# Altium project LPCB230__RLOOP__THERMAL_IF.PrjPCB
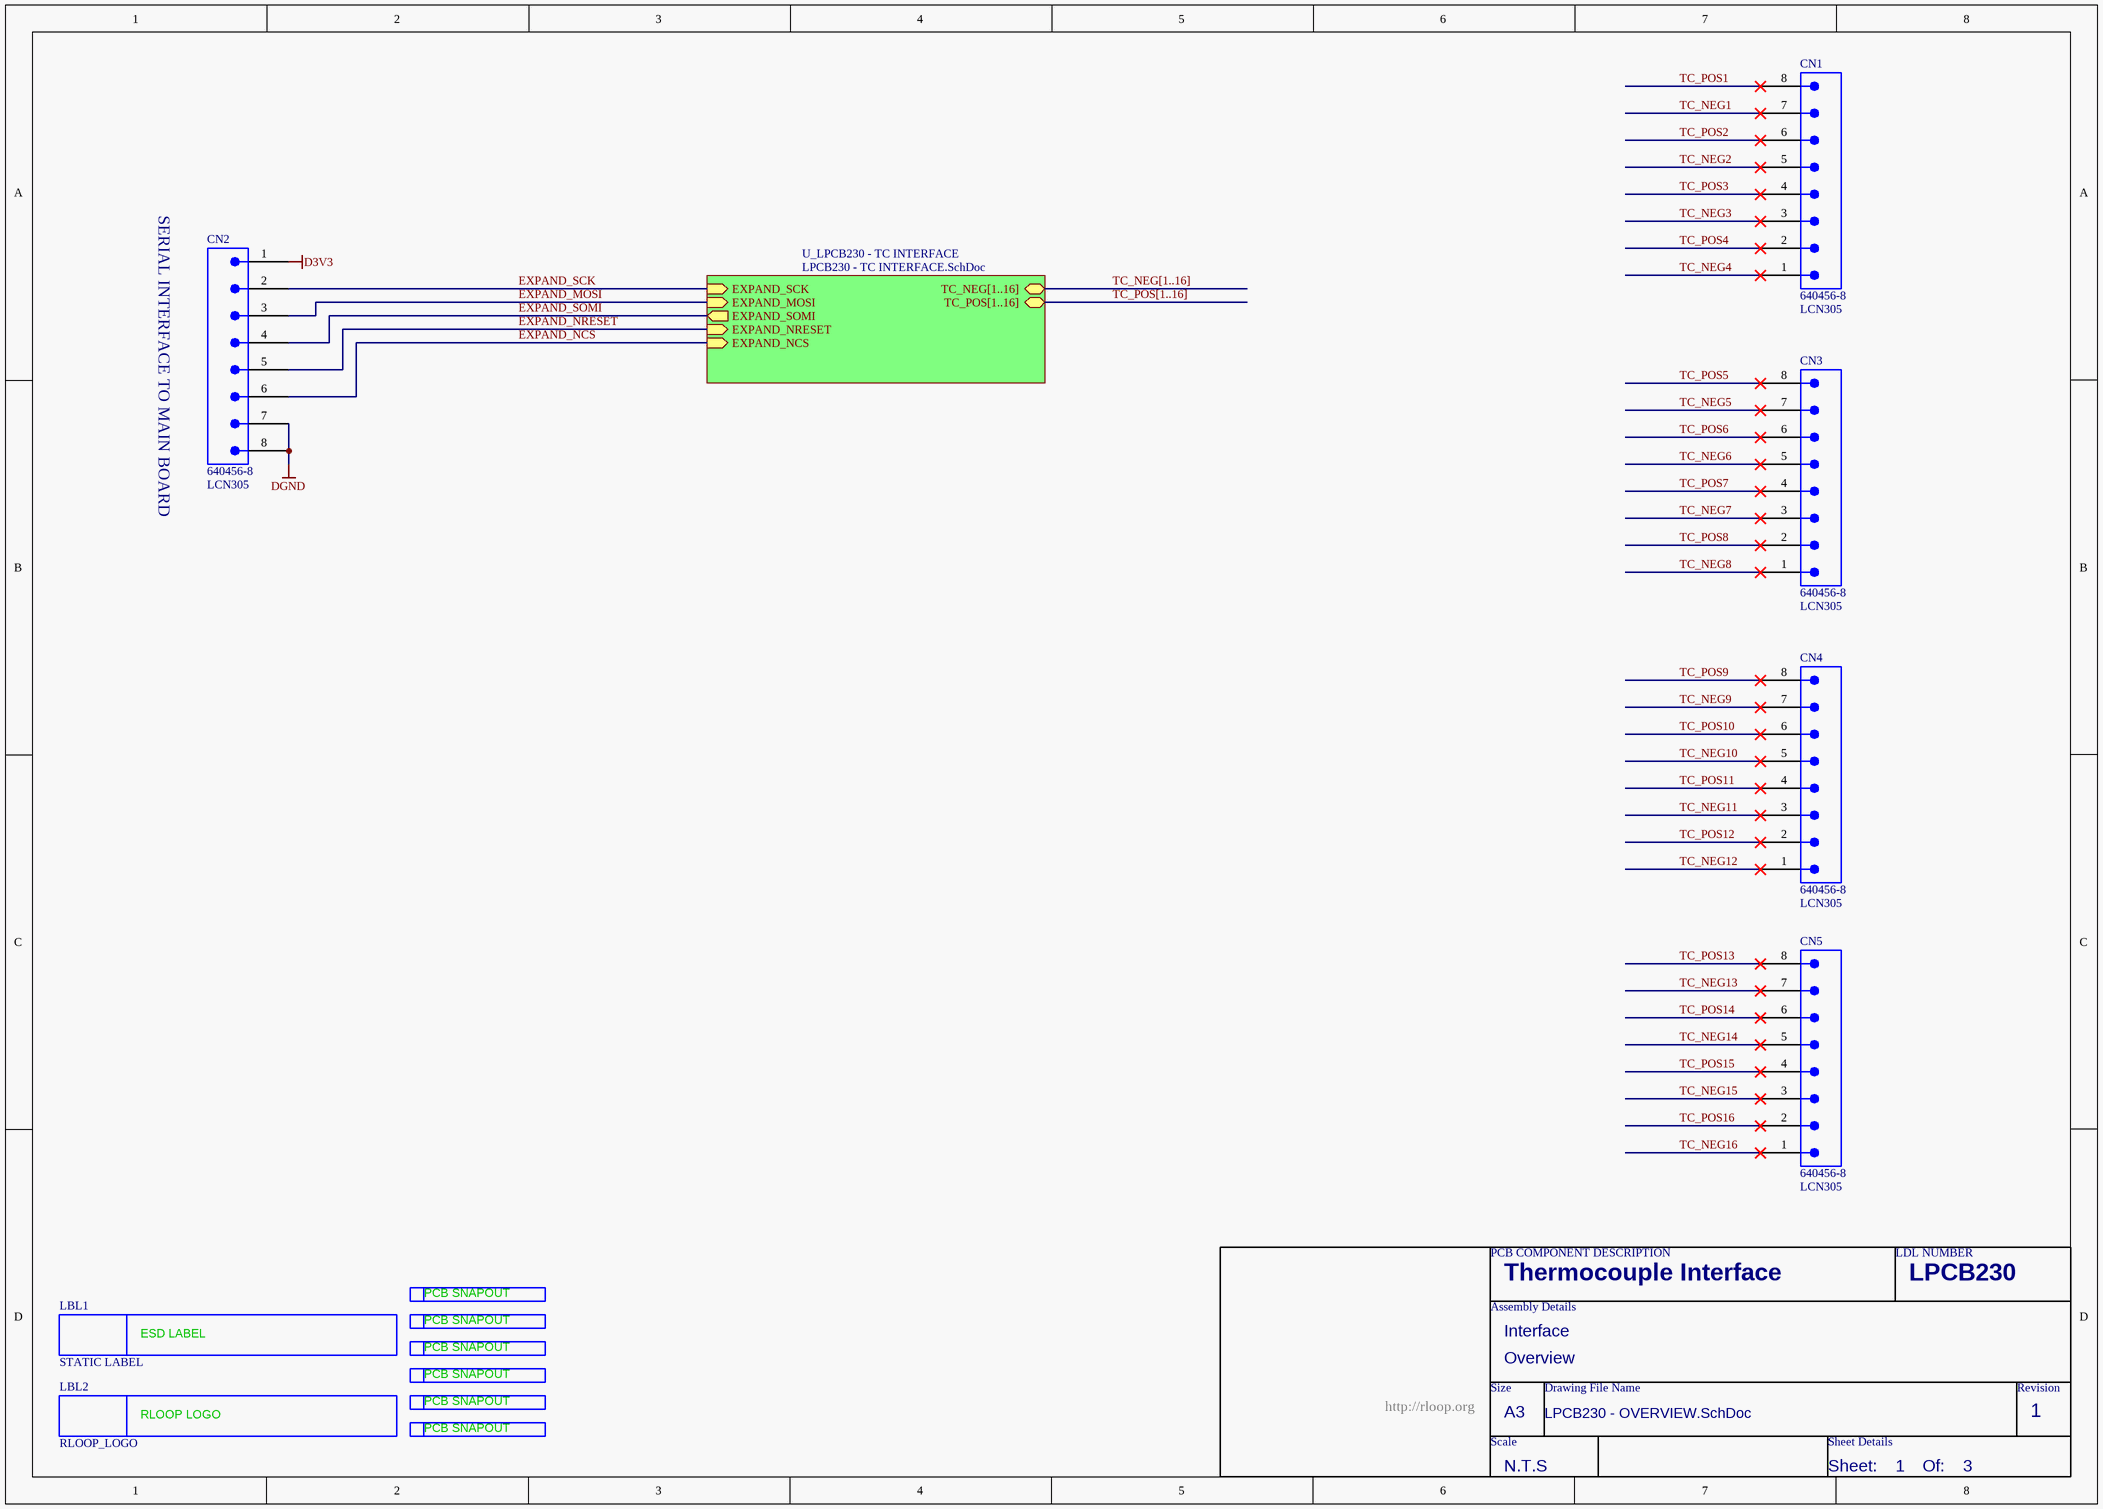
[diagram p0: LPCB230 - OVERVIEW.SchDoc]
3 sheets, 64 parts. Net scope: hierarchical (ports join the sheet entries above them; power ports are global).
Board files: LPCB230R0.PcbDoc, LPCB230R0__ASCII.PcbDoc
Sheets:
  LPCB230 - OVERVIEW.SchDoc
    U_LPCB230 - TC INTERFACE = LPCB230 - TC INTERFACE.SchDoc
      TC1 = LPCB230 - TC CHANNEL.SchDoc
      TC2 = LPCB230 - TC CHANNEL.SchDoc
      TC3 = LPCB230 - TC CHANNEL.SchDoc
      TC4 = LPCB230 - TC CHANNEL.SchDoc
      TC5 = LPCB230 - TC CHANNEL.SchDoc
      TC6 = LPCB230 - TC CHANNEL.SchDoc
      TC7 = LPCB230 - TC CHANNEL.SchDoc
      TC8 = LPCB230 - TC CHANNEL.SchDoc
      TC9 = LPCB230 - TC CHANNEL.SchDoc
      TC10 = LPCB230 - TC CHANNEL.SchDoc
      TC11 = LPCB230 - TC CHANNEL.SchDoc
      TC12 = LPCB230 - TC CHANNEL.SchDoc
      TC13 = LPCB230 - TC CHANNEL.SchDoc
      TC14 = LPCB230 - TC CHANNEL.SchDoc
      TC15 = LPCB230 - TC CHANNEL.SchDoc
      TC16 = LPCB230 - TC CHANNEL.SchDoc

## Sheet LPCB230 - OVERVIEW.SchDoc
size A3; Address1: Factory 10; Address2: 9-13 Dingley Avenue, Dandeong, VICTORIA 3175, AUSTRALIA; DocumentNumber: 1; Revision: 1; SheetNumber: 1; SheetTotal: 3; Lockie__PCB_SUB_ASSEMBLY: Overview; Lockie__PCB_ASSEMBLY: Interface; Lockie__LDL: LPCB230; Lockie__PCB_DESCRIPTION: Thermocouple Interface

### Parts
CN1  640456-8  LDL_NUMBER: LCN305  [640456-8]
CN2  640456-8  LDL_NUMBER: LCN305  [640456-8]
CN3  640456-8  LDL_NUMBER: LCN305  [640456-8]
CN4  640456-8  LDL_NUMBER: LCN305  [640456-8]
CN5  640456-8  LDL_NUMBER: LCN305  [640456-8]
LBL1  STATIC LABEL  [STATIC_LABEL]  (no BOM)
LBL2  RLOOP_LOGO  [RLOOP_LOGO]  (no BOM)
SN1  PCB_SNAPOUT  [SNAPOUT_NEW]  (value not drawn)  (no BOM)
SN2  PCB_SNAPOUT  [SNAPOUT_NEW]  (value not drawn)  (no BOM)
SN3  PCB_SNAPOUT  [SNAPOUT_NEW]  (value not drawn)  (no BOM)
SN4  PCB_SNAPOUT  [SNAPOUT_NEW]  (value not drawn)  (no BOM)
SN5  PCB_SNAPOUT  [SNAPOUT_NEW]  (value not drawn)  (no BOM)
SN6  PCB_SNAPOUT  [SNAPOUT_NEW]  (value not drawn)  (no BOM)

### Sub-sheets
U_LPCB230 - TC INTERFACE = LPCB230 - TC INTERFACE.SchDoc: EXPAND_SCK (in), EXPAND_MOSI (in), EXPAND_SOMI (out), EXPAND_NCS (in), EXPAND_NRESET (in), TC_NEG[1..16] (bidir), TC_POS[1..16] (bidir)

### Nets
D3V3: CN2.1
DGND: CN2.7 CN2.8
EXPAND_MOSI: CN2.3 ; sheet U_LPCB230 - TC INTERFACE/EXPAND_MOSI
EXPAND_NCS: CN2.6 ; sheet U_LPCB230 - TC INTERFACE/EXPAND_NCS
EXPAND_NRESET: CN2.5 ; sheet U_LPCB230 - TC INTERFACE/EXPAND_NRESET
EXPAND_SCK: CN2.2 ; sheet U_LPCB230 - TC INTERFACE/EXPAND_SCK
EXPAND_SOMI: CN2.4 ; sheet U_LPCB230 - TC INTERFACE/EXPAND_SOMI
TC_NEG1: CN1.7
TC_NEG2: CN1.5
TC_NEG3: CN1.3
TC_NEG4: CN1.1
TC_NEG5: CN3.7
TC_NEG6: CN3.5
TC_NEG7: CN3.3
TC_NEG8: CN3.1
TC_NEG9: CN4.7
TC_NEG10: CN4.5
TC_NEG11: CN4.3
TC_NEG12: CN4.1
TC_NEG13: CN5.7
TC_NEG14: CN5.5
TC_NEG15: CN5.3
TC_NEG16: CN5.1
TC_POS1: CN1.8
TC_POS2: CN1.6
TC_POS3: CN1.4
TC_POS4: CN1.2
TC_POS5: CN3.8
TC_POS6: CN3.6
TC_POS7: CN3.4
TC_POS8: CN3.2
TC_POS9: CN4.8
TC_POS10: CN4.6
TC_POS11: CN4.4
TC_POS12: CN4.2
TC_POS13: CN5.8
TC_POS14: CN5.6
TC_POS15: CN5.4
TC_POS16: CN5.2

### Buses and harness runs
bus TC_NEG[1..16] = sheet U_LPCB230 - TC INTERFACE/TC_NEG[1..16]
bus TC_POS[1..16] = sheet U_LPCB230 - TC INTERFACE/TC_POS[1..16]

### Notes on the sheet
- SERIAL INTERFACE TO MAIN BOARD
- PCB COMPONENT DESCRIPTION
- LDL NUMBER
- Assembly Details
- Size
- Drawing File Name
- Revision
- http://rloop.org
- Scale
- A3
- Sheet Details
- N.T.S
- Sheet:
- Of:
- (in symbol PCB_SNAPOUT) PCB SNAPOUT
- (in symbol RLOOP_LOGO) RLOOP LOGO
- (in symbol STATIC LABEL) ESD LABEL

### Library data of the parts
CN1-CN5 = 640456-8: Connector, Male Header, 8 Way; FMEDA__CHANNEL: COM; FMEDA__OPERATING__CURRENT_MAX: 0; FMEDA__OPERATING__TEMP_MAX: 50; FMEDA__OPERATING__TEMP_MIN: -20; FMEDA__OPERATING__TEMP_TYP: 27; FMEDA__OPERATING__VOLTAGE_MAX: 16; FMEDA__OPERATING__VOLTAGE_TYP: 12; FMEDA__FUNCTION_IN_SYSTEM: *; FMEDA__OPERATING__CURRENT_MIN: 0; FMEDA__OPERATING__CURRENT_TYP: 0; FMEDA__OPERATING__VOLTAGE_MIN: 0
LBL1 = STATIC LABEL: FMEDA__CHANNEL: DIAG; FMEDA__FUNCTION_IN_SYSTEM: *
LBL2 = RLOOP_LOGO: FMEDA__CHANNEL: DIAG; FMEDA__FUNCTION_IN_SYSTEM: *
SN1-SN6 = PCB_SNAPOUT: FMEDA__CHANNEL: DIAG; FMEDA__FUNCTION_IN_SYSTEM: *

## Sheet LPCB230 - TC INTERFACE.SchDoc
size A3; Address1: Factory 10; Address2: 9-13 Dingley Avenue, Dandeong, VICTORIA 3175, AUSTRALIA; DocumentNumber: 2; Revision: 1; SheetNumber: 2; SheetTotal: 3; Lockie__PCB_SUB_ASSEMBLY: Interface; Lockie__PCB_ASSEMBLY: Interface; Lockie__LDL: LPCB230; Lockie__PCB_DESCRIPTION: Thermocouple Interface
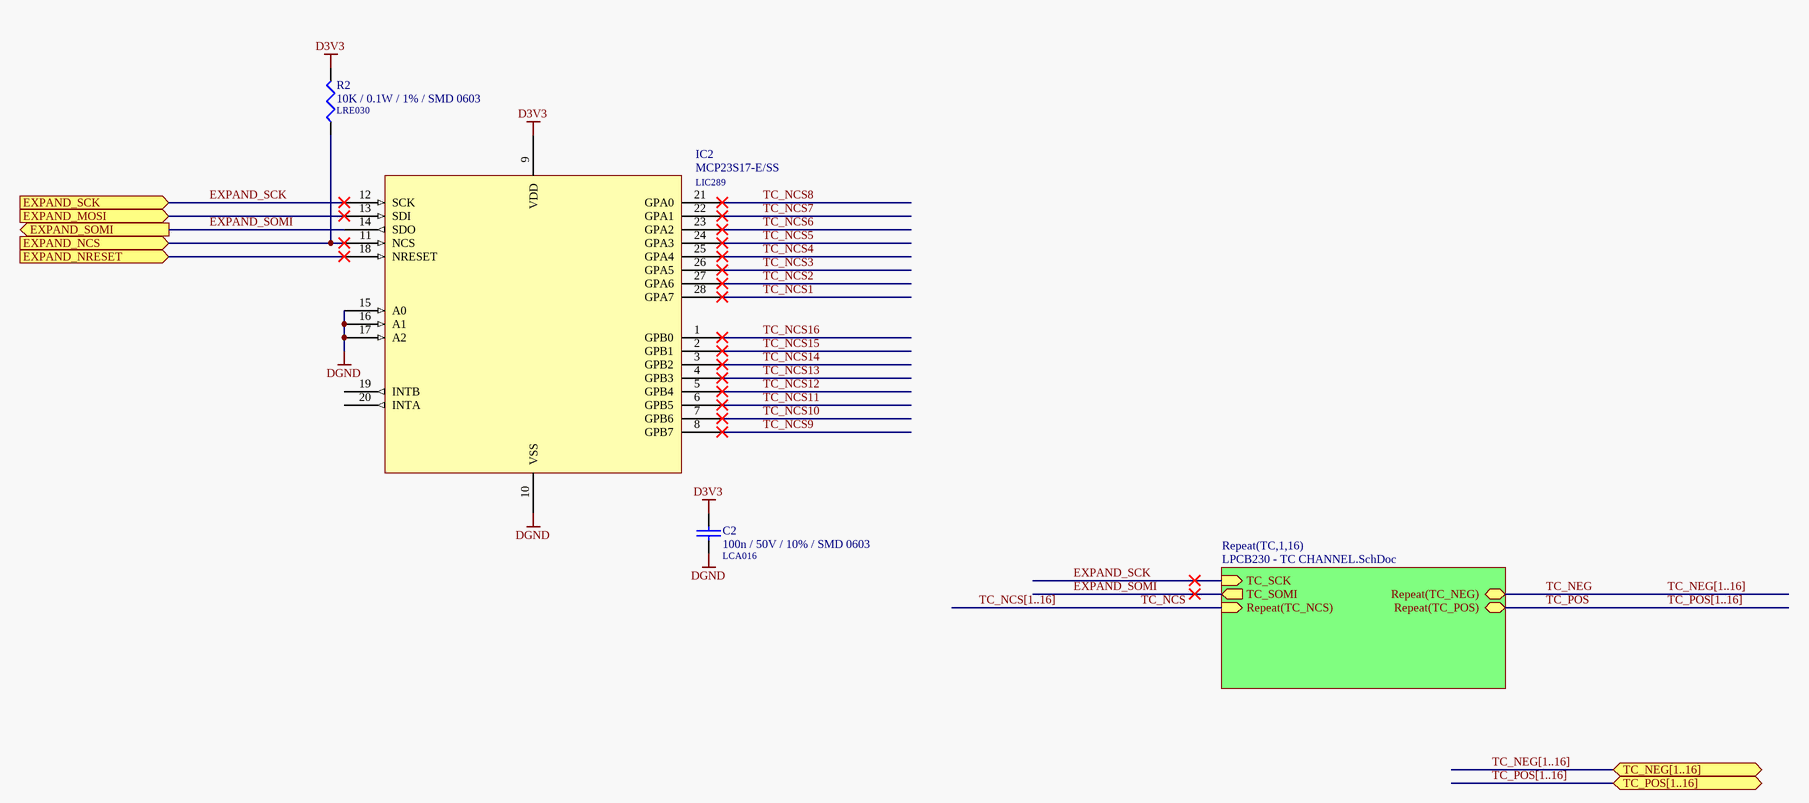
[diagram p1: LPCB230 - TC INTERFACE.SchDoc]

### Parts
C2  100n / 50V / 10% / SMD 0603  LDL_NUMBER: LCA016  [LFP011__CC1608-0603-IPC7351_B]
IC2  MCP23S17-E/SS  LDL_NUMBER: LIC289  [LFP050__SSOP28]
R2  10K / 0.1W / 1% / SMD 0603  LDL_NUMBER: LRE030  [LFP020__CR1608-0603-IPC7351_B]

### Sub-sheets
Repeat(TC,1,16) = LPCB230 - TC CHANNEL.SchDoc: Repeat(TC_NEG) (bidir), Repeat(TC_POS) (bidir), TC_SCK (in), TC_SOMI (out), Repeat(TC_NCS) (in)

### Ports
EXPAND_MOSI (in), EXPAND_NCS (in), EXPAND_NRESET (in), EXPAND_SCK (in), EXPAND_SOMI (out), TC_NEG[1..16] (bidir), TC_POS[1..16] (bidir)

### Nets
D3V3: C2.1 IC2.9(VDD) R2.2
DGND: C2.2 IC2.10(VSS) IC2.15(A0) IC2.16(A1) IC2.17(A2)
EXPAND_MOSI: IC2.13(SDI) ; port EXPAND_MOSI
EXPAND_NCS: IC2.11(NCS) R2.1 ; port EXPAND_NCS
EXPAND_NRESET: IC2.18(NRESET) ; port EXPAND_NRESET
EXPAND_SCK: IC2.12(SCK) ; port EXPAND_SCK, sheet Repeat(TC,1,16)/TC_SCK
EXPAND_SOMI: IC2.14(SDO) ; port EXPAND_SOMI, sheet Repeat(TC,1,16)/TC_SOMI
TC_NCS: sheet Repeat(TC,1,16)/Repeat(TC_NCS)
TC_NCS1: IC2.28(GPA7)
TC_NCS2: IC2.27(GPA6)
TC_NCS3: IC2.26(GPA5)
TC_NCS4: IC2.25(GPA4)
TC_NCS5: IC2.24(GPA3)
TC_NCS6: IC2.23(GPA2)
TC_NCS7: IC2.22(GPA1)
TC_NCS8: IC2.21(GPA0)
TC_NCS9: IC2.8(GPB7)
TC_NCS10: IC2.7(GPB6)
TC_NCS11: IC2.6(GPB5)
TC_NCS12: IC2.5(GPB4)
TC_NCS13: IC2.4(GPB3)
TC_NCS14: IC2.3(GPB2)
TC_NCS15: IC2.2(GPB1)
TC_NCS16: IC2.1(GPB0)
TC_NEG: sheet Repeat(TC,1,16)/Repeat(TC_NEG)
TC_POS: sheet Repeat(TC,1,16)/Repeat(TC_POS)

Not connected (* = marked no-connect by the designer): IC2 19(INTB) 20(INTA)

### Buses and harness runs
bus TC_NCS[1..16]
bus TC_NEG[1..16]
bus TC_NEG[1..16] = port TC_NEG[1..16]
bus TC_POS[1..16]
bus TC_POS[1..16] = port TC_POS[1..16]

### Notes on the sheet
- PCB COMPONENT DESCRIPTION
- LDL NUMBER
- Assembly Details
- Size
- Drawing File Name
- Revision
- http://rloop.org
- Scale
- A3
- Sheet Details
- N.T.S
- Sheet:
- Of:

### Library data of the parts
C2 = 100n / 50V / 10% / SMD 0603: Capacitor, Ceramic Chip, 100nF (0.1uF), 50V, 5%, SMD 0603 [LCA016]; FMEDA__OPERATING__VOLTAGE_MIN: 0; FMEDA__OPERATING__VOLTAGE_MAX: 3.3; FMEDA__OPERATING__TEMP_MIN: -20; FMEDA__OPERATING__TEMP_TYP: 27; FMEDA__OPERATING__TEMP_MAX: 50; FMEDA__CHANNEL: COM; Value: 100n; FMEDA__FUNCTION_IN_SYSTEM: *; FMEDA__OPERATING__VOLTAGE_TYP: 3.3
IC2 = MCP23S17-E/SS: IC, SPI IO Expander, 16bit, SMD SSOP28 [LIC289]; FMEDA__OPERATING__TEMP_MIN: -20; FMEDA__OPERATING__TEMP_TYP: 27; FMEDA__OPERATING__TEMP_MAX: 50; FMEDA__OPERATING__VOLTAGE_MIN: 0; FMEDA__OPERATING__VOLTAGE_TYP: 3.3; FMEDA__CHANNEL: COM; FMEDA__FUNCTION_IN_SYSTEM: *; FMEDA__OPERATING__VOLTAGE_MAX: 3.3
R2 = 10K / 0.1W / 1% / SMD 0603: Resistor, Ceramic Chip, 10K, 0.1W, 1%, SMD 0603 [LRE030]; FMEDA__OPERATING__POWER_MAX: 0; FMEDA__OPERATING__TEMP_MAX: 50; FMEDA__OPERATING__TEMP_MIN: -20; FMEDA__OPERATING__TEMP_TYP: 27; FMEDA__CHANNEL: COM; Value: 10K; FMEDA__OPERATING__POWER_MIN: 0; FMEDA__OPERATING__VOLTAGE_MAX: 0; FMEDA__OPERATING__VOLTAGE_MIN: 0; FMEDA__OPERATING__VOLTAGE_TYP: 0; FMEDA__FUNCTION_IN_SYSTEM: *

## Sheet LPCB230 - TC CHANNEL.SchDoc
size A3; Address1: Factory 10; Address2: 9-13 Dingley Avenue, Dandeong, VICTORIA 3175, AUSTRALIA; DocumentNumber: 3; Revision: 1; SheetNumber: 3; SheetTotal: 3; Lockie__PCB_SUB_ASSEMBLY: Single Channel; Lockie__PCB_ASSEMBLY: Interface; Lockie__LDL: LPCB230; Lockie__PCB_DESCRIPTION: Thermocouple Interface
Used 16 times, as channels U_LPCB230 - TC INTERFACE/TC1, U_LPCB230 - TC INTERFACE/TC2, U_LPCB230 - TC INTERFACE/TC3, U_LPCB230 - TC INTERFACE/TC4, U_LPCB230 - TC INTERFACE/TC5, U_LPCB230 - TC INTERFACE/TC6, U_LPCB230 - TC INTERFACE/TC7, U_LPCB230 - TC INTERFACE/TC8, U_LPCB230 - TC INTERFACE/TC9, U_LPCB230 - TC INTERFACE/TC10, U_LPCB230 - TC INTERFACE/TC11, U_LPCB230 - TC INTERFACE/TC12, U_LPCB230 - TC INTERFACE/TC13, U_LPCB230 - TC INTERFACE/TC14, U_LPCB230 - TC INTERFACE/TC15, U_LPCB230 - TC INTERFACE/TC16. Parts and nets are listed once, with the designators drawn on the sheet.
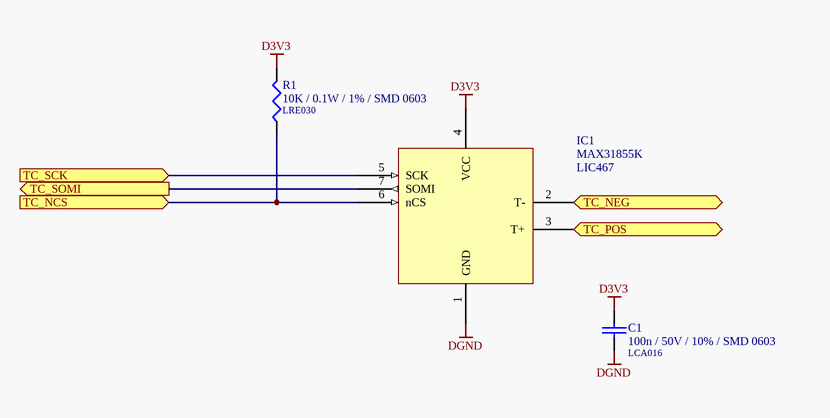
[diagram p2: LPCB230 - TC CHANNEL.SchDoc]

### Parts
C1  100n / 50V / 10% / SMD 0603  LDL_NUMBER: LCA016  [LFP011__CC1608-0603-IPC7351_B]
IC1  MAX31855K  LDL_NUMBER: LIC467  [LFP017__SO-G8/Y1.9]
R1  10K / 0.1W / 1% / SMD 0603  LDL_NUMBER: LRE030  [LFP020__CR1608-0603-IPC7351_B]

### Ports
TC_NCS (in), TC_NEG (bidir), TC_POS (bidir), TC_SCK (in), TC_SOMI (out)

### Nets
D3V3: C1.1 IC1.4(VCC) R1.2
DGND: C1.2 IC1.1(GND)
TC_NCS: IC1.6(nCS) R1.1 ; port TC_NCS
TC_NEG: IC1.2(T-) ; port TC_NEG
TC_POS: IC1.3(T+) ; port TC_POS
TC_SCK: IC1.5(SCK) ; port TC_SCK
TC_SOMI: IC1.7(SOMI) ; port TC_SOMI

### Channels
U_LPCB230 - TC INTERFACE/TC1: designators end in _TC1; ports TC_NCS=TC_NCS1 TC_NEG=TC_NEG1 TC_POS=TC_POS1 TC_SCK=EXPAND_SCK TC_SOMI=EXPAND_SOMI
U_LPCB230 - TC INTERFACE/TC2: designators end in _TC2; ports TC_NCS=TC_NCS2 TC_NEG=TC_NEG2 TC_POS=TC_POS2 TC_SCK=EXPAND_SCK TC_SOMI=EXPAND_SOMI
U_LPCB230 - TC INTERFACE/TC3: designators end in _TC3; ports TC_NCS=TC_NCS3 TC_NEG=TC_NEG3 TC_POS=TC_POS3 TC_SCK=EXPAND_SCK TC_SOMI=EXPAND_SOMI
U_LPCB230 - TC INTERFACE/TC4: designators end in _TC4; ports TC_NCS=TC_NCS4 TC_NEG=TC_NEG4 TC_POS=TC_POS4 TC_SCK=EXPAND_SCK TC_SOMI=EXPAND_SOMI
U_LPCB230 - TC INTERFACE/TC5: designators end in _TC5; ports TC_NCS=TC_NCS5 TC_NEG=TC_NEG5 TC_POS=TC_POS5 TC_SCK=EXPAND_SCK TC_SOMI=EXPAND_SOMI
U_LPCB230 - TC INTERFACE/TC6: designators end in _TC6; ports TC_NCS=TC_NCS6 TC_NEG=TC_NEG6 TC_POS=TC_POS6 TC_SCK=EXPAND_SCK TC_SOMI=EXPAND_SOMI
U_LPCB230 - TC INTERFACE/TC7: designators end in _TC7; ports TC_NCS=TC_NCS7 TC_NEG=TC_NEG7 TC_POS=TC_POS7 TC_SCK=EXPAND_SCK TC_SOMI=EXPAND_SOMI
U_LPCB230 - TC INTERFACE/TC8: designators end in _TC8; ports TC_NCS=TC_NCS8 TC_NEG=TC_NEG8 TC_POS=TC_POS8 TC_SCK=EXPAND_SCK TC_SOMI=EXPAND_SOMI
U_LPCB230 - TC INTERFACE/TC9: designators end in _TC9; ports TC_NCS=TC_NCS9 TC_NEG=TC_NEG9 TC_POS=TC_POS9 TC_SCK=EXPAND_SCK TC_SOMI=EXPAND_SOMI
U_LPCB230 - TC INTERFACE/TC10: designators end in _TC10; ports TC_NCS=TC_NCS10 TC_NEG=TC_NEG10 TC_POS=TC_POS10 TC_SCK=EXPAND_SCK TC_SOMI=EXPAND_SOMI
U_LPCB230 - TC INTERFACE/TC11: designators end in _TC11; ports TC_NCS=TC_NCS11 TC_NEG=TC_NEG11 TC_POS=TC_POS11 TC_SCK=EXPAND_SCK TC_SOMI=EXPAND_SOMI
U_LPCB230 - TC INTERFACE/TC12: designators end in _TC12; ports TC_NCS=TC_NCS12 TC_NEG=TC_NEG12 TC_POS=TC_POS12 TC_SCK=EXPAND_SCK TC_SOMI=EXPAND_SOMI
U_LPCB230 - TC INTERFACE/TC13: designators end in _TC13; ports TC_NCS=TC_NCS13 TC_NEG=TC_NEG13 TC_POS=TC_POS13 TC_SCK=EXPAND_SCK TC_SOMI=EXPAND_SOMI
U_LPCB230 - TC INTERFACE/TC14: designators end in _TC14; ports TC_NCS=TC_NCS14 TC_NEG=TC_NEG14 TC_POS=TC_POS14 TC_SCK=EXPAND_SCK TC_SOMI=EXPAND_SOMI
U_LPCB230 - TC INTERFACE/TC15: designators end in _TC15; ports TC_NCS=TC_NCS15 TC_NEG=TC_NEG15 TC_POS=TC_POS15 TC_SCK=EXPAND_SCK TC_SOMI=EXPAND_SOMI
U_LPCB230 - TC INTERFACE/TC16: designators end in _TC16; ports TC_NCS=TC_NCS16 TC_NEG=TC_NEG16 TC_POS=TC_POS16 TC_SCK=EXPAND_SCK TC_SOMI=EXPAND_SOMI

### Notes on the sheet
- PCB COMPONENT DESCRIPTION
- LDL NUMBER
- Assembly Details
- Size
- Drawing File Name
- Revision
- http://rloop.org
- Scale
- A3
- Sheet Details
- N.T.S
- Sheet:
- Of:

### Library data of the parts
C1 = 100n / 50V / 10% / SMD 0603: as C2 on sheet LPCB230 - TC INTERFACE; Value: 100n; FMEDA__FUNCTION_IN_SYSTEM: *; FMEDA__OPERATING__VOLTAGE_TYP: 3.3
IC1 = MAX31855K: IC, Thermocouple Interface, Type K, SMD SOIC-8 [LIC467]
R1 = 10K / 0.1W / 1% / SMD 0603: as R2 on sheet LPCB230 - TC INTERFACE; Value: 10K; FMEDA__OPERATING__POWER_MIN: 0; FMEDA__OPERATING__VOLTAGE_MAX: 0; FMEDA__OPERATING__VOLTAGE_MIN: 0; FMEDA__OPERATING__VOLTAGE_TYP: 0; FMEDA__FUNCTION_IN_SYSTEM: *

## Nets that join several sheets
D3V3: LPCB230 - OVERVIEW (CN2.1), LPCB230 - TC INTERFACE (C2.1 IC2.9 R2.2), U_LPCB230 - TC INTERFACE/TC1 (C1_TC1.1 IC1_TC1.4 R1_TC1.2), U_LPCB230 - TC INTERFACE/TC2 (C1_TC2.1 IC1_TC2.4 R1_TC2.2), U_LPCB230 - TC INTERFACE/TC3 (C1_TC3.1 IC1_TC3.4 R1_TC3.2), U_LPCB230 - TC INTERFACE/TC4 (C1_TC4.1 IC1_TC4.4 R1_TC4.2), U_LPCB230 - TC INTERFACE/TC5 (C1_TC5.1 IC1_TC5.4 R1_TC5.2), U_LPCB230 - TC INTERFACE/TC6 (C1_TC6.1 IC1_TC6.4 R1_TC6.2), U_LPCB230 - TC INTERFACE/TC7 (C1_TC7.1 IC1_TC7.4 R1_TC7.2), U_LPCB230 - TC INTERFACE/TC8 (C1_TC8.1 IC1_TC8.4 R1_TC8.2), U_LPCB230 - TC INTERFACE/TC9 (C1_TC9.1 IC1_TC9.4 R1_TC9.2), U_LPCB230 - TC INTERFACE/TC10 (C1_TC10.1 IC1_TC10.4 R1_TC10.2), U_LPCB230 - TC INTERFACE/TC11 (C1_TC11.1 IC1_TC11.4 R1_TC11.2), U_LPCB230 - TC INTERFACE/TC12 (C1_TC12.1 IC1_TC12.4 R1_TC12.2), U_LPCB230 - TC INTERFACE/TC13 (C1_TC13.1 IC1_TC13.4 R1_TC13.2), U_LPCB230 - TC INTERFACE/TC14 (C1_TC14.1 IC1_TC14.4 R1_TC14.2), U_LPCB230 - TC INTERFACE/TC15 (C1_TC15.1 IC1_TC15.4 R1_TC15.2), U_LPCB230 - TC INTERFACE/TC16 (C1_TC16.1 IC1_TC16.4 R1_TC16.2)
DGND: LPCB230 - OVERVIEW (CN2.7 CN2.8), LPCB230 - TC INTERFACE (5 pins), U_LPCB230 - TC INTERFACE/TC1 (C1_TC1.2 IC1_TC1.1), U_LPCB230 - TC INTERFACE/TC2 (C1_TC2.2 IC1_TC2.1), U_LPCB230 - TC INTERFACE/TC3 (C1_TC3.2 IC1_TC3.1), U_LPCB230 - TC INTERFACE/TC4 (C1_TC4.2 IC1_TC4.1), U_LPCB230 - TC INTERFACE/TC5 (C1_TC5.2 IC1_TC5.1), U_LPCB230 - TC INTERFACE/TC6 (C1_TC6.2 IC1_TC6.1), U_LPCB230 - TC INTERFACE/TC7 (C1_TC7.2 IC1_TC7.1), U_LPCB230 - TC INTERFACE/TC8 (C1_TC8.2 IC1_TC8.1), U_LPCB230 - TC INTERFACE/TC9 (C1_TC9.2 IC1_TC9.1), U_LPCB230 - TC INTERFACE/TC10 (C1_TC10.2 IC1_TC10.1), U_LPCB230 - TC INTERFACE/TC11 (C1_TC11.2 IC1_TC11.1), U_LPCB230 - TC INTERFACE/TC12 (C1_TC12.2 IC1_TC12.1), U_LPCB230 - TC INTERFACE/TC13 (C1_TC13.2 IC1_TC13.1), U_LPCB230 - TC INTERFACE/TC14 (C1_TC14.2 IC1_TC14.1), U_LPCB230 - TC INTERFACE/TC15 (C1_TC15.2 IC1_TC15.1), U_LPCB230 - TC INTERFACE/TC16 (C1_TC16.2 IC1_TC16.1)
EXPAND_MOSI: LPCB230 - OVERVIEW (CN2.3), LPCB230 - TC INTERFACE (IC2.13)
EXPAND_NCS: LPCB230 - OVERVIEW (CN2.6), LPCB230 - TC INTERFACE (IC2.11 R2.1)
EXPAND_NRESET: LPCB230 - OVERVIEW (CN2.5), LPCB230 - TC INTERFACE (IC2.18)
EXPAND_SCK: LPCB230 - OVERVIEW (CN2.2), LPCB230 - TC INTERFACE (IC2.12), U_LPCB230 - TC INTERFACE/TC1 (IC1_TC1.5), U_LPCB230 - TC INTERFACE/TC2 (IC1_TC2.5), U_LPCB230 - TC INTERFACE/TC3 (IC1_TC3.5), U_LPCB230 - TC INTERFACE/TC4 (IC1_TC4.5), U_LPCB230 - TC INTERFACE/TC5 (IC1_TC5.5), U_LPCB230 - TC INTERFACE/TC6 (IC1_TC6.5), U_LPCB230 - TC INTERFACE/TC7 (IC1_TC7.5), U_LPCB230 - TC INTERFACE/TC8 (IC1_TC8.5), U_LPCB230 - TC INTERFACE/TC9 (IC1_TC9.5), U_LPCB230 - TC INTERFACE/TC10 (IC1_TC10.5), U_LPCB230 - TC INTERFACE/TC11 (IC1_TC11.5), U_LPCB230 - TC INTERFACE/TC12 (IC1_TC12.5), U_LPCB230 - TC INTERFACE/TC13 (IC1_TC13.5), U_LPCB230 - TC INTERFACE/TC14 (IC1_TC14.5), U_LPCB230 - TC INTERFACE/TC15 (IC1_TC15.5), U_LPCB230 - TC INTERFACE/TC16 (IC1_TC16.5)
EXPAND_SOMI: LPCB230 - OVERVIEW (CN2.4), LPCB230 - TC INTERFACE (IC2.14), U_LPCB230 - TC INTERFACE/TC1 (IC1_TC1.7), U_LPCB230 - TC INTERFACE/TC2 (IC1_TC2.7), U_LPCB230 - TC INTERFACE/TC3 (IC1_TC3.7), U_LPCB230 - TC INTERFACE/TC4 (IC1_TC4.7), U_LPCB230 - TC INTERFACE/TC5 (IC1_TC5.7), U_LPCB230 - TC INTERFACE/TC6 (IC1_TC6.7), U_LPCB230 - TC INTERFACE/TC7 (IC1_TC7.7), U_LPCB230 - TC INTERFACE/TC8 (IC1_TC8.7), U_LPCB230 - TC INTERFACE/TC9 (IC1_TC9.7), U_LPCB230 - TC INTERFACE/TC10 (IC1_TC10.7), U_LPCB230 - TC INTERFACE/TC11 (IC1_TC11.7), U_LPCB230 - TC INTERFACE/TC12 (IC1_TC12.7), U_LPCB230 - TC INTERFACE/TC13 (IC1_TC13.7), U_LPCB230 - TC INTERFACE/TC14 (IC1_TC14.7), U_LPCB230 - TC INTERFACE/TC15 (IC1_TC15.7), U_LPCB230 - TC INTERFACE/TC16 (IC1_TC16.7)
TC_NCS1: LPCB230 - TC INTERFACE (IC2.28), U_LPCB230 - TC INTERFACE/TC1 (IC1_TC1.6 R1_TC1.1)
TC_NCS2: LPCB230 - TC INTERFACE (IC2.27), U_LPCB230 - TC INTERFACE/TC2 (IC1_TC2.6 R1_TC2.1)
TC_NCS3: LPCB230 - TC INTERFACE (IC2.26), U_LPCB230 - TC INTERFACE/TC3 (IC1_TC3.6 R1_TC3.1)
TC_NCS4: LPCB230 - TC INTERFACE (IC2.25), U_LPCB230 - TC INTERFACE/TC4 (IC1_TC4.6 R1_TC4.1)
TC_NCS5: LPCB230 - TC INTERFACE (IC2.24), U_LPCB230 - TC INTERFACE/TC5 (IC1_TC5.6 R1_TC5.1)
TC_NCS6: LPCB230 - TC INTERFACE (IC2.23), U_LPCB230 - TC INTERFACE/TC6 (IC1_TC6.6 R1_TC6.1)
TC_NCS7: LPCB230 - TC INTERFACE (IC2.22), U_LPCB230 - TC INTERFACE/TC7 (IC1_TC7.6 R1_TC7.1)
TC_NCS8: LPCB230 - TC INTERFACE (IC2.21), U_LPCB230 - TC INTERFACE/TC8 (IC1_TC8.6 R1_TC8.1)
TC_NCS9: LPCB230 - TC INTERFACE (IC2.8), U_LPCB230 - TC INTERFACE/TC9 (IC1_TC9.6 R1_TC9.1)
TC_NCS10: LPCB230 - TC INTERFACE (IC2.7), U_LPCB230 - TC INTERFACE/TC10 (IC1_TC10.6 R1_TC10.1)
TC_NCS11: LPCB230 - TC INTERFACE (IC2.6), U_LPCB230 - TC INTERFACE/TC11 (IC1_TC11.6 R1_TC11.1)
TC_NCS12: LPCB230 - TC INTERFACE (IC2.5), U_LPCB230 - TC INTERFACE/TC12 (IC1_TC12.6 R1_TC12.1)
TC_NCS13: LPCB230 - TC INTERFACE (IC2.4), U_LPCB230 - TC INTERFACE/TC13 (IC1_TC13.6 R1_TC13.1)
TC_NCS14: LPCB230 - TC INTERFACE (IC2.3), U_LPCB230 - TC INTERFACE/TC14 (IC1_TC14.6 R1_TC14.1)
TC_NCS15: LPCB230 - TC INTERFACE (IC2.2), U_LPCB230 - TC INTERFACE/TC15 (IC1_TC15.6 R1_TC15.1)
TC_NCS16: LPCB230 - TC INTERFACE (IC2.1), U_LPCB230 - TC INTERFACE/TC16 (IC1_TC16.6 R1_TC16.1)
TC_NEG1: LPCB230 - OVERVIEW (CN1.7), U_LPCB230 - TC INTERFACE/TC1 (IC1_TC1.2)
TC_NEG2: LPCB230 - OVERVIEW (CN1.5), U_LPCB230 - TC INTERFACE/TC2 (IC1_TC2.2)
TC_NEG3: LPCB230 - OVERVIEW (CN1.3), U_LPCB230 - TC INTERFACE/TC3 (IC1_TC3.2)
TC_NEG4: LPCB230 - OVERVIEW (CN1.1), U_LPCB230 - TC INTERFACE/TC4 (IC1_TC4.2)
TC_NEG5: LPCB230 - OVERVIEW (CN3.7), U_LPCB230 - TC INTERFACE/TC5 (IC1_TC5.2)
TC_NEG6: LPCB230 - OVERVIEW (CN3.5), U_LPCB230 - TC INTERFACE/TC6 (IC1_TC6.2)
TC_NEG7: LPCB230 - OVERVIEW (CN3.3), U_LPCB230 - TC INTERFACE/TC7 (IC1_TC7.2)
TC_NEG8: LPCB230 - OVERVIEW (CN3.1), U_LPCB230 - TC INTERFACE/TC8 (IC1_TC8.2)
TC_NEG9: LPCB230 - OVERVIEW (CN4.7), U_LPCB230 - TC INTERFACE/TC9 (IC1_TC9.2)
TC_NEG10: LPCB230 - OVERVIEW (CN4.5), U_LPCB230 - TC INTERFACE/TC10 (IC1_TC10.2)
TC_NEG11: LPCB230 - OVERVIEW (CN4.3), U_LPCB230 - TC INTERFACE/TC11 (IC1_TC11.2)
TC_NEG12: LPCB230 - OVERVIEW (CN4.1), U_LPCB230 - TC INTERFACE/TC12 (IC1_TC12.2)
TC_NEG13: LPCB230 - OVERVIEW (CN5.7), U_LPCB230 - TC INTERFACE/TC13 (IC1_TC13.2)
TC_NEG14: LPCB230 - OVERVIEW (CN5.5), U_LPCB230 - TC INTERFACE/TC14 (IC1_TC14.2)
TC_NEG15: LPCB230 - OVERVIEW (CN5.3), U_LPCB230 - TC INTERFACE/TC15 (IC1_TC15.2)
TC_NEG16: LPCB230 - OVERVIEW (CN5.1), U_LPCB230 - TC INTERFACE/TC16 (IC1_TC16.2)
TC_POS1: LPCB230 - OVERVIEW (CN1.8), U_LPCB230 - TC INTERFACE/TC1 (IC1_TC1.3)
TC_POS2: LPCB230 - OVERVIEW (CN1.6), U_LPCB230 - TC INTERFACE/TC2 (IC1_TC2.3)
TC_POS3: LPCB230 - OVERVIEW (CN1.4), U_LPCB230 - TC INTERFACE/TC3 (IC1_TC3.3)
TC_POS4: LPCB230 - OVERVIEW (CN1.2), U_LPCB230 - TC INTERFACE/TC4 (IC1_TC4.3)
TC_POS5: LPCB230 - OVERVIEW (CN3.8), U_LPCB230 - TC INTERFACE/TC5 (IC1_TC5.3)
TC_POS6: LPCB230 - OVERVIEW (CN3.6), U_LPCB230 - TC INTERFACE/TC6 (IC1_TC6.3)
TC_POS7: LPCB230 - OVERVIEW (CN3.4), U_LPCB230 - TC INTERFACE/TC7 (IC1_TC7.3)
TC_POS8: LPCB230 - OVERVIEW (CN3.2), U_LPCB230 - TC INTERFACE/TC8 (IC1_TC8.3)
TC_POS9: LPCB230 - OVERVIEW (CN4.8), U_LPCB230 - TC INTERFACE/TC9 (IC1_TC9.3)
TC_POS10: LPCB230 - OVERVIEW (CN4.6), U_LPCB230 - TC INTERFACE/TC10 (IC1_TC10.3)
TC_POS11: LPCB230 - OVERVIEW (CN4.4), U_LPCB230 - TC INTERFACE/TC11 (IC1_TC11.3)
TC_POS12: LPCB230 - OVERVIEW (CN4.2), U_LPCB230 - TC INTERFACE/TC12 (IC1_TC12.3)
TC_POS13: LPCB230 - OVERVIEW (CN5.8), U_LPCB230 - TC INTERFACE/TC13 (IC1_TC13.3)
TC_POS14: LPCB230 - OVERVIEW (CN5.6), U_LPCB230 - TC INTERFACE/TC14 (IC1_TC14.3)
TC_POS15: LPCB230 - OVERVIEW (CN5.4), U_LPCB230 - TC INTERFACE/TC15 (IC1_TC15.3)
TC_POS16: LPCB230 - OVERVIEW (CN5.2), U_LPCB230 - TC INTERFACE/TC16 (IC1_TC16.3)